# EAGLE schematic lawn_manager_v1_0 (EAGLE 6.5.0)
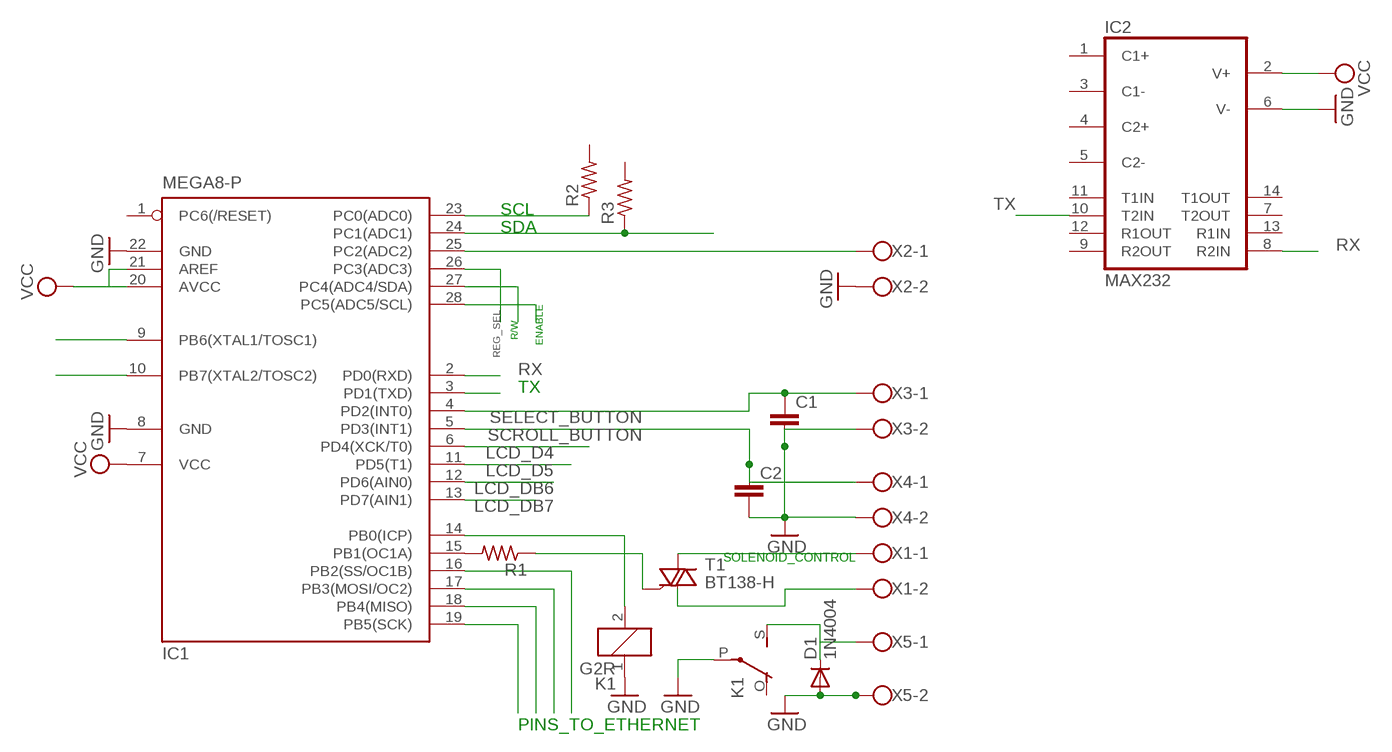
[diagram p0: schematic, sheet 1]

## Parts
C1  C2.5/2  [C2.5-2]
C2  C2.5/2  [C2.5-2]
D1  1N4004  [DO41-10]
IC1  MEGA8-P  [DIL28-3]
IC2  MAX232  [DIL16]
K1  G2R  [G2R]
R1  R-US_0207/10  [0207/10]
R2  R-US_0204/5  [0204/5]
R3  R-US_0204/5  [0204/5]
T1  BT138-H  [TO220BH]
X1  W237-102  [W237-102]
X2  W237-102  [W237-102]
X3  W237-102  [W237-102]
X4  W237-102  [W237-102]
X5  W237-102  [W237-102]

## Nets
ENABLE: IC1.28(PC5(ADC5/SCL))
GND: C1.2 C2.2 D1.A IC1.8(GND) IC1.22(GND) IC2.6(V-) K1.1 K1.P(2:P) X2.2 X3.2 X4.2 X5.2
LCD_D4: IC1.6(PD4(XCK/T0))
LCD_D5: IC1.11(PD5(T1))
LCD_DB6: IC1.12(PD6(AIN0))
LCD_DB7: IC1.13(PD7(AIN1))
N$1: IC1.10(PB7(XTAL2/TOSC2))
N$2: IC1.9(PB6(XTAL1/TOSC1))
N$3: IC1.15(PB1(OC1A)) R1.2
N$4: D1.C K1.S(2:S) X5.1
N$5: R1.1 T1.G
N$6: IC1.16(PB2(SS/OC1B))
N$7: IC1.17(PB3(MOSI/OC2))
N$8: T1.T1(A1) X1.2
N$11: IC1.18(PB4(MISO))
N$12: IC1.14(PB0(ICP)) K1.2
N$13: IC1.25(PC2(ADC2)) X2.1
PINS_TO_ETHERNET: IC1.19(PB5(SCK))
R/W: IC1.27(PC4(ADC4/SDA))
REG_SEL: IC1.26(PC3(ADC3))
RX: IC1.2(PD0(RXD)) IC2.8(R2IN)
SCL: IC1.23(PC0(ADC0)) R2.1
SCROLL_BUTTON: C2.1 IC1.5(PD3(INT1)) X4.1
SDA: IC1.24(PC1(ADC1)) R3.1
SELECT_BUTTON: C1.1 IC1.4(PD2(INT0)) X3.1
SOLENOID_CONTROL: T1.T2(A2) X1.1
TX: IC1.3(PD1(TXD)) IC2.10(T2IN)
VCC: IC1.7(VCC) IC1.20(AVCC) IC1.21(AREF) IC2.2(V+)
Unconnected: IC1.1(PC6(/RESET)) IC2.1(C1+) IC2.3(C1-) IC2.4(C2+) IC2.5(C2-) IC2.7(T2OUT) IC2.9(R2OUT) IC2.11(T1IN) IC2.12(R1OUT) IC2.13(R1IN) IC2.14(T1OUT) K1.O(2:O) R2.2 R3.2

## Power pins joined to a net without a drawn wire
GND: IC2.15(GND)
VCC: IC2.16(VCC)

## Library data of the parts
C1 C2 = capacitor-wima:C: CAPACITOR naming: grid - package width
D1 = diode:1N4004: DIODE general purpose rectifier, 1 A
IC1 = atmel:MEGA8-P: MICROCONTROLLER 8 Kbytes FLASH, 1 kbytes SRAM, 512 bytes EEPROM, USART, 4-channel 10 bit ADC, 2-channel 8 bit ADC Pin compatible with Atmega48, ATMega88, ATMega168 Source: avr.lbr; OC_FARNELL: unknown; OC_NEWARK: unknown
IC2 = maxim:MAX232: RS232 TRANSCEIVER; MF: MAXIM; MPN: MAX232ACPE+; OC_FARNELL: 9723773; OC_NEWARK: 68K4544
K1 = relay:G2R: RELAY 1 x switch, Omron; OC_FARNELL: 1569185; OC_NEWARK: unknown
R1-R3 = rcl:R-US_: RESISTOR, American symbol
T1 = triac:BT138: TRIAC Source: http://www.semiconductors.philips.com BT138_SERIES_2.pdf
X1-X5 = con-wago-500:W237-102: WAGO SCREW CLAMP; MPN: 237-102; OC_FARNELL: unknown; OC_NEWARK: 70K9898